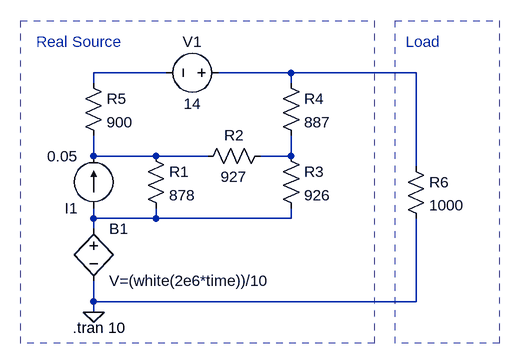
[diagram p0: schematic Var93.asc]
Var93.asc, the LTspice schematic file:
Version 4
SHEET 1 880 680
WIRE 224 -112 112 -112
WIRE 416 -112 304 -112
WIRE 608 -112 416 -112
WIRE 112 -96 112 -112
WIRE 416 -96 416 -112
WIRE 112 16 112 -16
WIRE 208 16 112 16
WIRE 288 16 208 16
WIRE 416 16 416 -16
WIRE 416 16 368 16
WIRE 608 32 608 -112
WIRE 112 112 112 96
WIRE 208 112 208 96
WIRE 208 112 112 112
WIRE 416 112 416 96
WIRE 416 112 208 112
WIRE 112 128 112 112
WIRE 112 240 112 208
WIRE 608 240 608 112
WIRE 608 240 112 240
WIRE 112 256 112 240
FLAG 112 256 0
SYMBOL bv 112 112 R0
SYMATTR InstName B1
SYMATTR Value V=(white(2e6*time))/10
SYMBOL current 112 96 R180
WINDOW 123 0 0 Left 0
WINDOW 39 0 0 Left 0
SYMATTR InstName I1
SYMATTR Value 0.05
SYMBOL res 192 0 R0
SYMATTR InstName R1
SYMATTR Value 878
SYMBOL res 384 0 R90
WINDOW 0 0 56 VBottom 2
WINDOW 3 32 56 VTop 2
SYMATTR InstName R2
SYMATTR Value 927
SYMBOL res 400 0 R0
SYMATTR InstName R3
SYMATTR Value 926
SYMBOL res 400 -112 R0
SYMATTR InstName R4
SYMATTR Value 887
SYMBOL res 96 -112 R0
SYMATTR InstName R5
SYMATTR Value 900
SYMBOL voltage 320 -112 R90
WINDOW 0 -32 56 VBottom 2
WINDOW 3 32 56 VTop 2
WINDOW 123 0 0 Left 0
WINDOW 39 0 0 Left 0
SYMATTR InstName V1
SYMATTR Value 14
SYMBOL res 592 16 R0
SYMATTR InstName R6
SYMATTR Value 1000
TEXT 80 280 Left 2 !.tran 10
TEXT 24 -160 Left 2 ;Real Source
TEXT 592 -160 Left 2 ;Load
RECTANGLE Normal 544 304 0 -192 1
RECTANGLE Normal 736 304 576 -192 1

The netlist it stands for:
* Var93.asc
B1 N005 0 V=(white(2e6*time))/10
I1 N005 N003 0.05
R1 N003 N005 878
R2 N004 N003 927
R3 N004 N005 926
R4 N002 N004 887
R5 N001 N003 900
V1 N002 N001 14
R6 N002 0 1000
.tran 10
* Real Source
* Load
.backanno
.end